# Altium schematic sheet CON_MC_PCI Express Mini_J1_52PIN.SchDoc: PCI Express Mini 52 Pin mating connector
size A4; Revision: 5; Organization: Altium Limited.
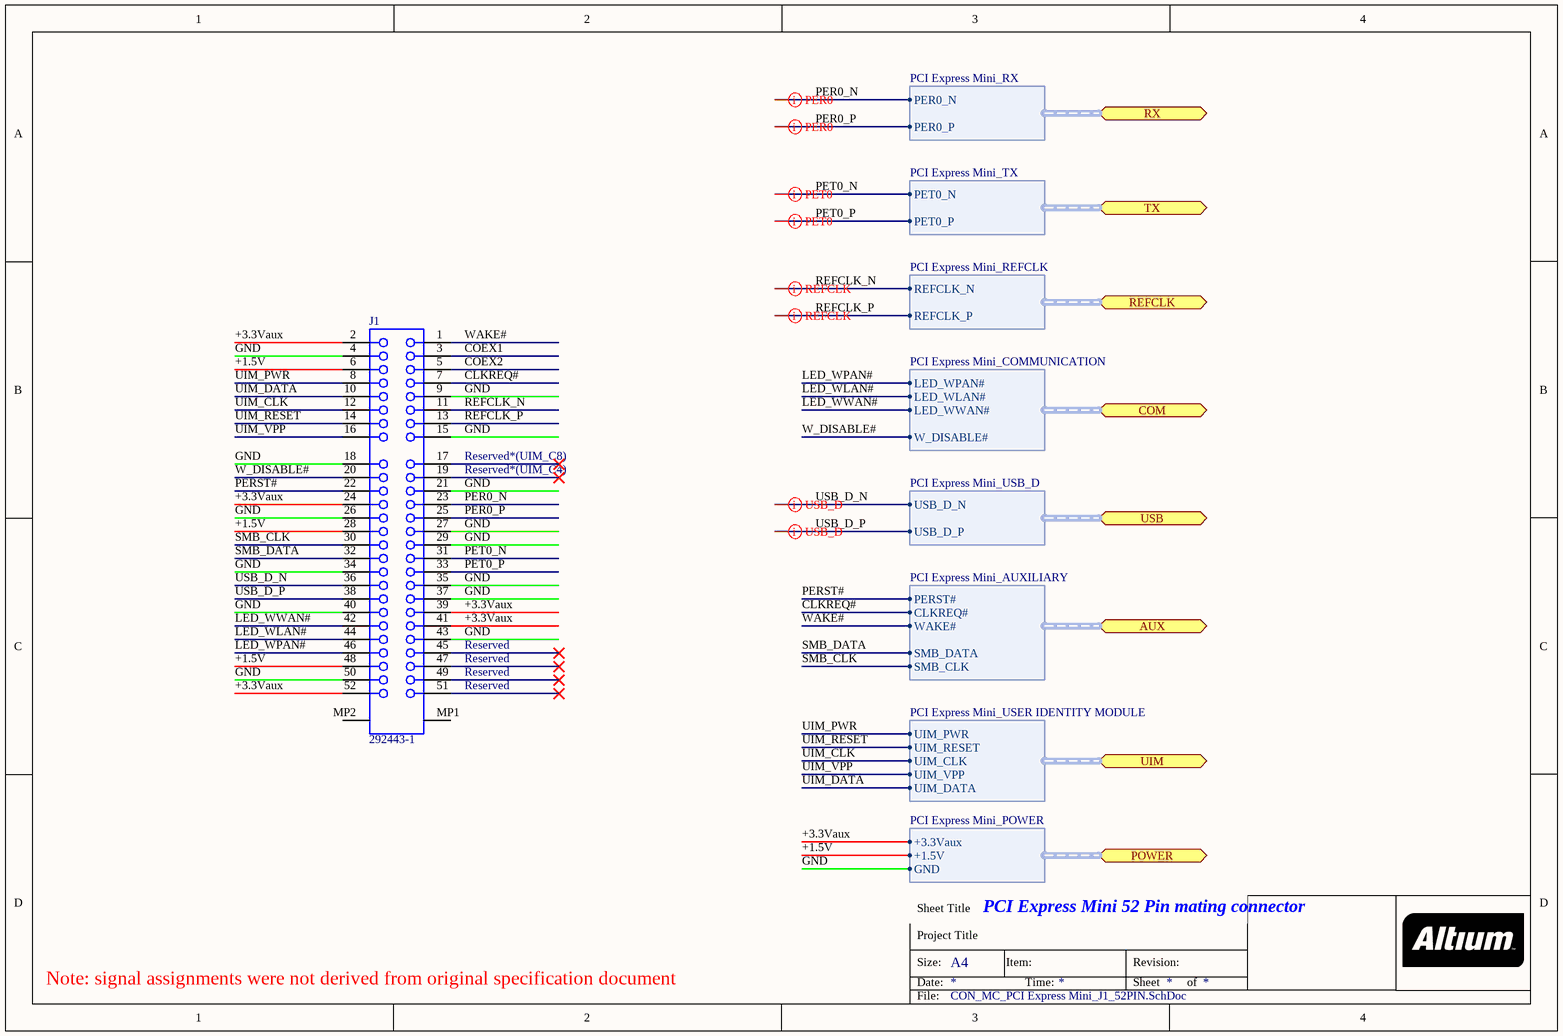
[diagram p0: CON_MC_PCI Express Mini_J1_52PIN.SchDoc]

## Parts
J1  292443-1  [BTB-SM0-8-2H52F]

## Ports
AUX (harness PCI Express Mini_AUXILIARY), COM (harness PCI Express Mini_COMMUNICATION), POWER (harness PCI Express Mini_POWER), REFCLK (harness PCI Express Mini_REFCLK), RX (harness PCI Express Mini_RX), TX (harness PCI Express Mini_TX), UIM (harness PCI Express Mini_USER IDENTITY MODULE), USB (harness PCI Express Mini_USB_D)

## Harnesses
PCI Express Mini_REFCLK: REFCLK_N, REFCLK_P
PCI Express Mini_RX: PER0_N, PER0_P
PCI Express Mini_TX: PET0_N, PET0_P
PCI Express Mini_USB_D: USB_D_N, USB_D_P
PCI Express Mini_POWER: +3.3Vaux, +1.5V, GND
PCI Express Mini_AUXILIARY: PERST#, CLKREQ#, WAKE#, SMB_DATA, SMB_CLK
PCI Express Mini_COMMUNICATION: LED_WPAN#, LED_WLAN#, LED_WWAN#, W_DISABLE#
PCI Express Mini_USER IDENTITY MODULE: UIM_PWR, UIM_RESET, UIM_CLK, UIM_VPP, UIM_DATA

## Nets
+1.5V: J1.6 J1.28 J1.48 ; port POWER.+1.5V
+3.3Vaux: J1.2 J1.24 J1.39 J1.41 J1.52 ; port POWER.+3.3Vaux
CLKREQ#: J1.7 ; port AUX.CLKREQ#
COEX1: J1.3
COEX2: J1.5
GND: J1.4 J1.9 J1.15 J1.18 J1.21 J1.26 J1.27 J1.29 J1.34 J1.35 J1.37 J1.40 J1.43 J1.50 ; port POWER.GND
LED_WLAN#: J1.44 ; port COM.LED_WLAN#
LED_WPAN#: J1.46 ; port COM.LED_WPAN#
LED_WWAN#: J1.42 ; port COM.LED_WWAN#
PER0_N: J1.23 ; port RX.PER0_N
PER0_P: J1.25 ; port RX.PER0_P
PERST#: J1.22 ; port AUX.PERST#
PET0_N: J1.31 ; port TX.PET0_N
PET0_P: J1.33 ; port TX.PET0_P
REFCLK_N: J1.11 ; port REFCLK.REFCLK_N
REFCLK_P: J1.13 ; port REFCLK.REFCLK_P
SMB_CLK: J1.30 ; port AUX.SMB_CLK
SMB_DATA: J1.32 ; port AUX.SMB_DATA
UIM_CLK: J1.12 ; port UIM.UIM_CLK
UIM_DATA: J1.10 ; port UIM.UIM_DATA
UIM_PWR: J1.8 ; port UIM.UIM_PWR
UIM_RESET: J1.14 ; port UIM.UIM_RESET
UIM_VPP: J1.16 ; port UIM.UIM_VPP
USB_D_N: J1.36 ; port USB.USB_D_N
USB_D_P: J1.38 ; port USB.USB_D_P
W_DISABLE#: J1.20 ; port COM.W_DISABLE#
WAKE#: J1.1 ; port AUX.WAKE#

Not connected (* = marked no-connect by the designer): J1 17* 19* 45* 47* 49* 51* MP1(53) MP2(54)

## Layout directives
differential pair: PER0_N, PER0_P, PET0_N, PET0_P, REFCLK_N, REFCLK_P, USB_D_N, USB_D_P

## Notes on the sheet
- (near J1) Reserved*(UIM_C8)
- (near J1) Reserved*(UIM_C4)
- (near J1) Reserved
- Note: signal assignments were not derived from original specification document
- Sheet Title
- Project Title
- Size:
- Date:
- A4
- Item:
- Time:
- Revision:
- Sheet
- of
- File:

## Library data of the parts
J1 = CMP-0001-00120-1: Board-to-Board Connector, SMT, Right Angle, Pitch 0.8mm, 52-Position, Female; Mating Connector: PCIeMini-CN-2S-M-R52; Publisher: Altium; Package Reference: BTB-SM0-8-2H52F; Datasheet Version: Oct-2006; ClassName: Board Template Connector; Component Kind: Standard